# Altium schematic sheet RST10UF50V0161_RST10UF50V016.schdoc
size 127 x 99 mm
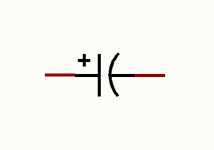
[diagram p0: RST10UF50V0161_RST10UF50V016.schdoc]

## Parts
C?  10uF  [CAP-SMD_BD5.0-L5.3-W5.3-FD]  (value not drawn)

## Nets

Not connected (* = marked no-connect by the designer): C? 1 2

## Library data of the parts
C? = RST10UF50V016: Manufacturer: KNSCHA(科尼盛); Add into BOM: yes; Tolerance: ±20%; Rated Voltage: 50V; Ripple Current: 24mA@120Hz; φD: 5mm; L: 5.4mm; Lifetime @ Temp: 2000hrs@105℃; Symbol: RST10UF50V016; Device: RST10UF50V016; LCSC Part Name: 10uF ±20% 50V; Supplier Part: C4747971; Manufacturer Part: RST10UF50V016; Supplier Footprint: SMD,D5xL5.4mm; JLCPCB Part Class: Extended Part; Datasheet: https://atta.szlcsc.com/upload/public/pdf/source/20220722/47144637C831FC4476CE4962252D8002.pdf; Supplier: LCSC; Convert to PCB: yes; Value: 10uF; Equivalent Series Resistance(ESR): -; Operating Temperature: -40℃~+105℃